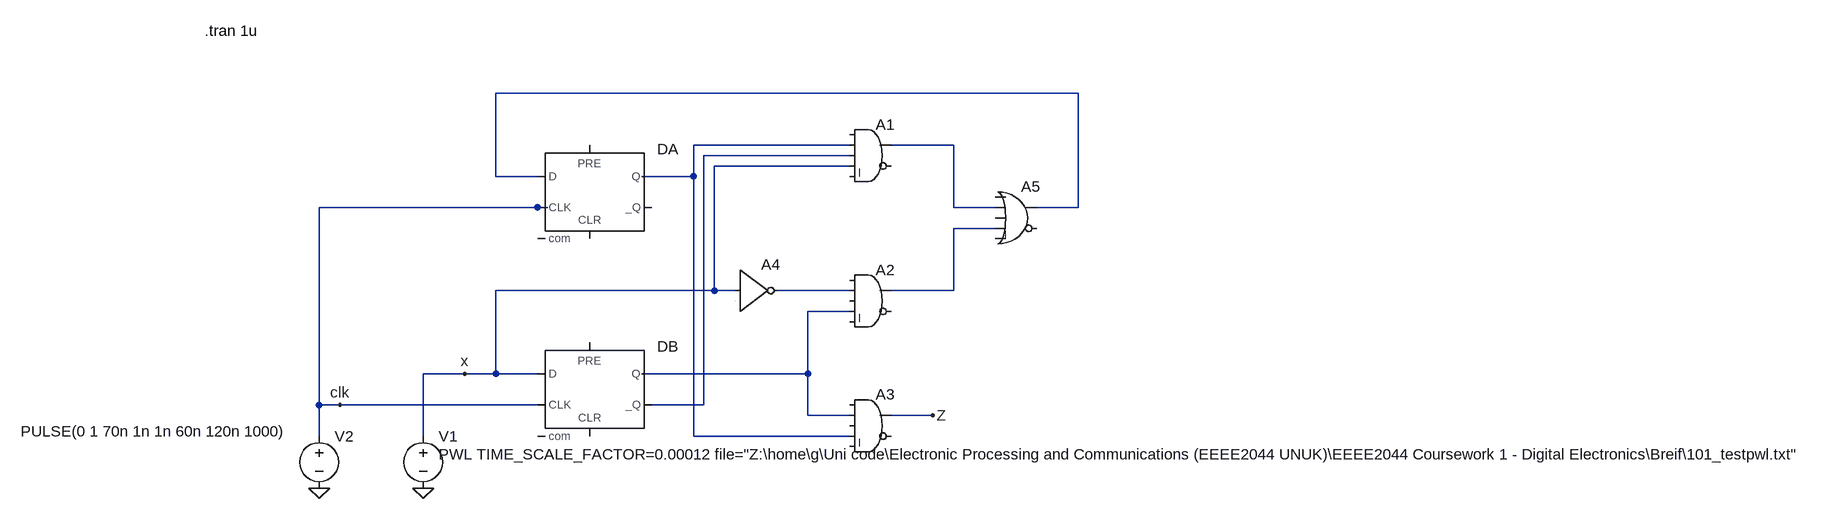
[diagram p0: schematic Q5.asc]
Q5.asc, the LTspice schematic file:
Version 4
SHEET 1 2256 680
WIRE 960 -336 64 -336
WIRE 608 -256 368 -256
WIRE 768 -256 672 -256
WIRE 608 -240 384 -240
WIRE 608 -224 400 -224
WIRE 64 -208 64 -336
WIRE 128 -208 64 -208
WIRE 368 -208 368 -256
WIRE 368 -208 288 -208
WIRE 128 -160 -208 -160
WIRE 144 -160 128 -160
WIRE 768 -160 768 -256
WIRE 832 -160 768 -160
WIRE 960 -160 960 -336
WIRE 960 -160 896 -160
WIRE 832 -128 768 -128
WIRE 400 -32 400 -224
WIRE 400 -32 64 -32
WIRE 432 -32 400 -32
WIRE 608 -32 496 -32
WIRE 768 -32 768 -128
WIRE 768 -32 672 -32
WIRE 608 0 544 0
WIRE 16 96 -48 96
WIRE 64 96 64 -32
WIRE 64 96 16 96
WIRE 128 96 64 96
WIRE 544 96 544 0
WIRE 544 96 288 96
WIRE -208 144 -208 -160
WIRE -176 144 -208 144
WIRE 128 144 -176 144
WIRE 384 144 384 -240
WIRE 384 144 304 144
WIRE 544 160 544 96
WIRE 608 160 544 160
WIRE 736 160 672 160
WIRE -208 192 -208 144
WIRE -48 192 -48 96
WIRE 368 192 368 -208
WIRE 608 192 368 192
FLAG -208 272 0
FLAG -48 272 0
FLAG 736 160 Z
FLAG -176 144 clk
FLAG 16 96 x
SYMBOL Digital\\dflop 208 48 R0
SYMATTR InstName DB
SYMATTR SpiceLine Td=40n
SYMBOL Digital\\dflop 208 -256 R0
SYMATTR InstName DA
SYMATTR SpiceLine Td=40n
SYMBOL Digital\\inv 432 -96 R0
SYMATTR InstName A4
SYMATTR SpiceLine Td=22n
SYMBOL Digital\\and 640 -304 R0
SYMATTR InstName A1
SYMATTR SpiceLine Td=27n
SYMBOL Digital\\and 640 -80 R0
SYMATTR InstName A2
SYMATTR SpiceLine Td=27n
SYMBOL Digital\\and 640 112 R0
SYMATTR InstName A3
SYMATTR SpiceLine2 Td=27n
SYMBOL Digital\\or 864 -208 R0
SYMATTR InstName A5
SYMATTR SpiceLine Td=22n
SYMBOL voltage -48 176 R0
WINDOW 3 24 44 Left 2
SYMATTR Value PWL TIME_SCALE_FACTOR=0.00012 file="Z:\home\g\Uni code\Electronic Processing and Communications (EEEE2044 UNUK)\EEEE2044 Coursework 1 - Digital Electronics\Breif\101_testpwl.txt"
SYMATTR InstName V1
SYMBOL voltage -208 176 R0
WINDOW 3 -459 9 Left 2
WINDOW 123 0 0 Left 0
WINDOW 39 0 0 Left 0
SYMATTR Value PULSE(0 1 70n 1n 1n 60n 120n 1000)
SYMATTR InstName V2
TEXT -384 -432 Left 2 !.tran 1u

The netlist it stands for:
* Q5.asc
A§DB x 0 clk 0 0 N004 N007 0 DFLOP Td=40n
A§DA N001 0 clk 0 0 0 N002 0 DFLOP Td=40n
A4 x 0 0 0 0 N006 0 0 BUF Td=22n
A1 0 N002 N004 x 0 0 N003 0 AND Td=27n
A2 0 N006 0 N007 0 0 N005 0 AND Td=27n
A3 0 N007 0 N002 0 0 Z 0 AND Td=27n
A5 0 N003 0 N005 0 0 N001 0 OR Td=22n
V1 x 0 PWL TIME_SCALE_FACTOR=0.00012 file="Z:\home\g\Uni code\Electronic Processing and Communications (EEEE2044 UNUK)\EEEE2044 Coursework 1 - Digital Electronics\Breif\101_testpwl.txt"
V2 clk 0 PULSE(0 1 70n 1n 1n 60n 120n 1000)
.tran 1u
.backanno
.end

* Results of the author's LTspice run, read from the files saved beside the schematic
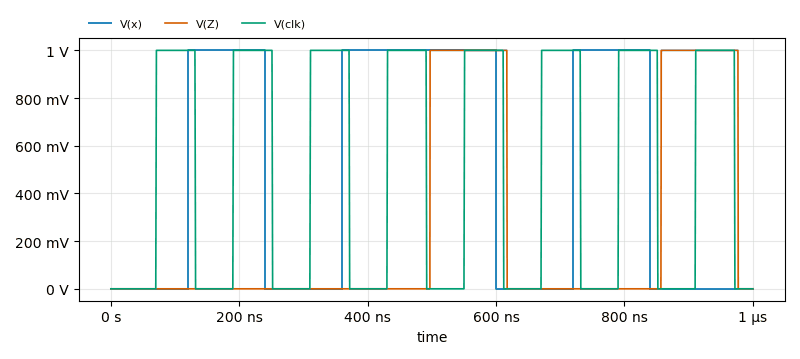
[diagram p1: Transient Analysis of Q5.asc, plotted from the saved traces]
* Transient Analysis, 1 run:
*   V(x): min 0 V, max 1 V, average 480 mV, rms 692.8 mV, last 0 V
*   V(Z): min 0 V, max 1 V, average 239.9 mV, rms 489.7 mV, last 0 V
*   V(clk): min 0 V, max 1 V, average 488 mV, rms 698.3 mV, last 0 V